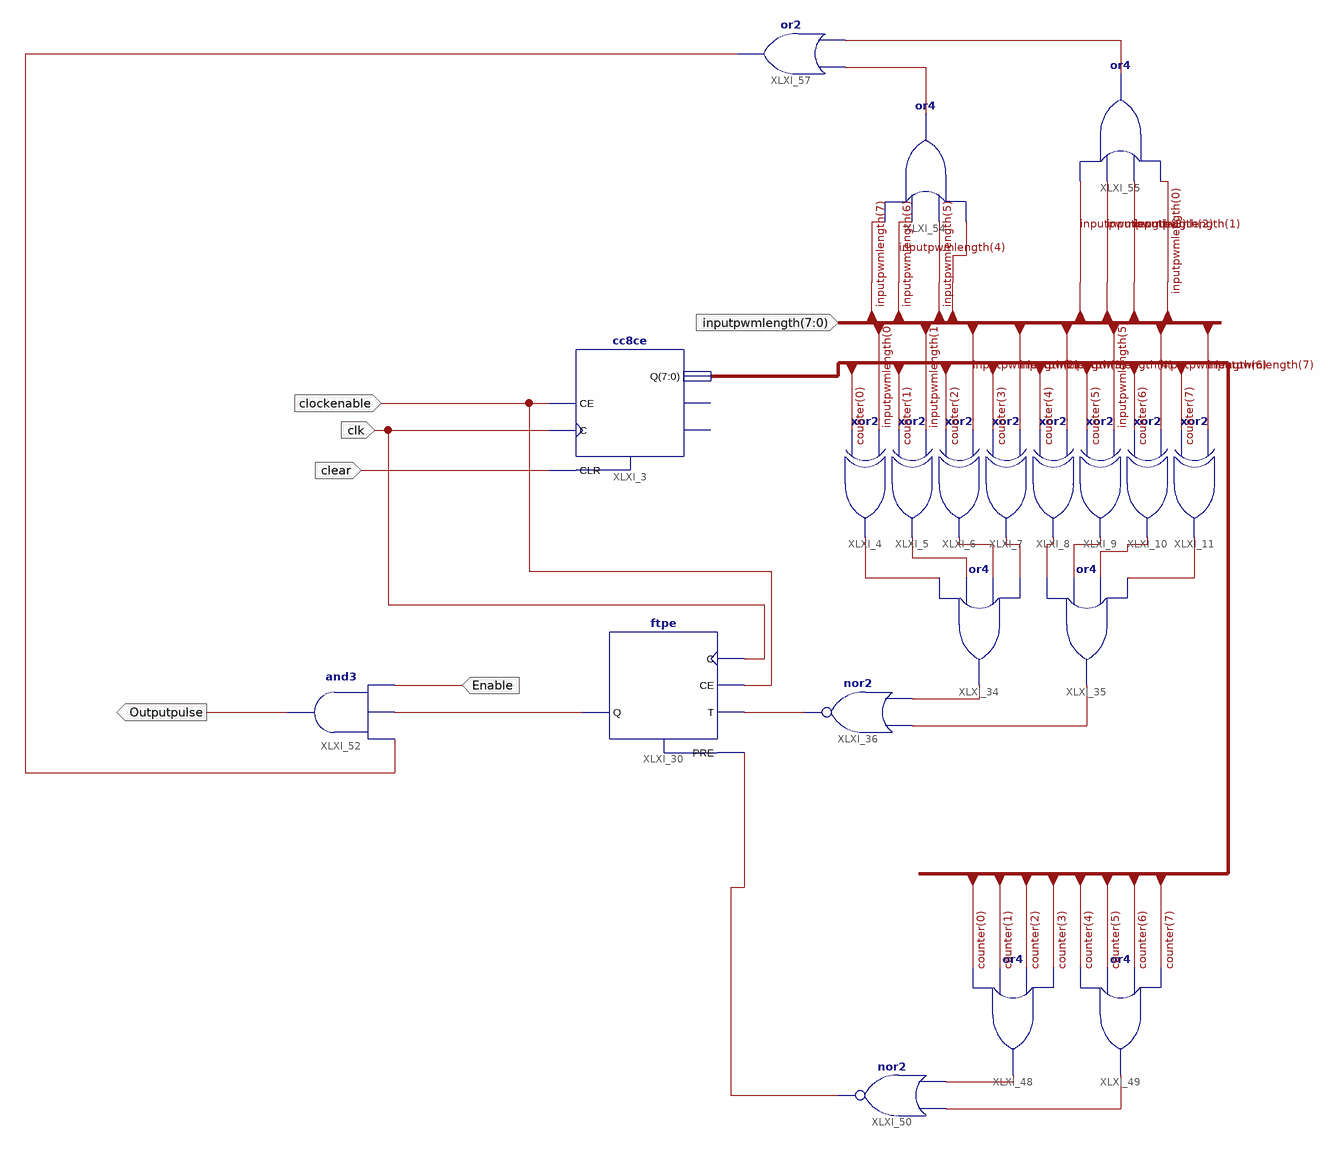
[diagram p0: schematic sheet 1]
// Xilinx ISE schematic counter.sch (spartan3e) as structural Verilog: 20 symbols, 6 ports
module counter (
  input  clk,
  input  clear,
  input  [7:0] inputpwmlength,
  input  clockenable,
  input  Enable,
  output Outputpulse
);

  wire XLXN_29, XLXN_30, XLXN_31, XLXN_32, XLXN_33, XLXN_34, XLXN_35, XLXN_36, XLXN_101, XLXN_106, XLXN_107,
       XLXN_110, XLXN_111, XLXN_114, XLXN_128, XLXN_129, XLXN_143, XLXN_144;
  wire [7:0] counter;

  cc8ce XLXI_3 (.C(clk), .CE(clockenable), .CLR(clear), .Q(counter));  // open: CEO, TC
  xor XLXI_5 (XLXN_30, counter[1], inputpwmlength[1]);
  xor XLXI_6 (XLXN_31, counter[2], inputpwmlength[2]);
  xor XLXI_7 (XLXN_32, counter[3], inputpwmlength[3]);
  xor XLXI_8 (XLXN_33, counter[4], inputpwmlength[4]);
  xor XLXI_9 (XLXN_34, counter[5], inputpwmlength[5]);
  xor XLXI_10 (XLXN_35, counter[6], inputpwmlength[6]);
  xor XLXI_11 (XLXN_36, counter[7], inputpwmlength[7]);
  xor XLXI_4 (XLXN_29, counter[0], inputpwmlength[0]);
  or XLXI_34 (XLXN_110, XLXN_29, XLXN_30, XLXN_31, XLXN_32);
  or XLXI_35 (XLXN_111, XLXN_33, XLXN_34, XLXN_35, XLXN_36);
  nor XLXI_36 (XLXN_101, XLXN_110, XLXN_111);
  or XLXI_48 (XLXN_106, counter[0], counter[1], counter[2], counter[3]);
  or XLXI_49 (XLXN_107, counter[4], counter[5], counter[6], counter[7]);
  nor XLXI_50 (XLXN_129, XLXN_106, XLXN_107);
  ftpe XLXI_30 (.C(clk), .CE(clockenable), .PRE(XLXN_129), .T(XLXN_101), .Q(XLXN_114));
  and XLXI_52 (Outputpulse, Enable, XLXN_114, XLXN_128);
  or XLXI_54 (XLXN_143, inputpwmlength[4], inputpwmlength[5], inputpwmlength[6], inputpwmlength[7]);
  or XLXI_55 (XLXN_144, inputpwmlength[0], inputpwmlength[1], inputpwmlength[2], inputpwmlength[3]);
  or XLXI_57 (XLXN_128, XLXN_144, XLXN_143);
endmodule
